# Altium schematic sheet Title.SchDoc
size 420 x 297 mm; SheetNumber: 1; SheetTotal: 3
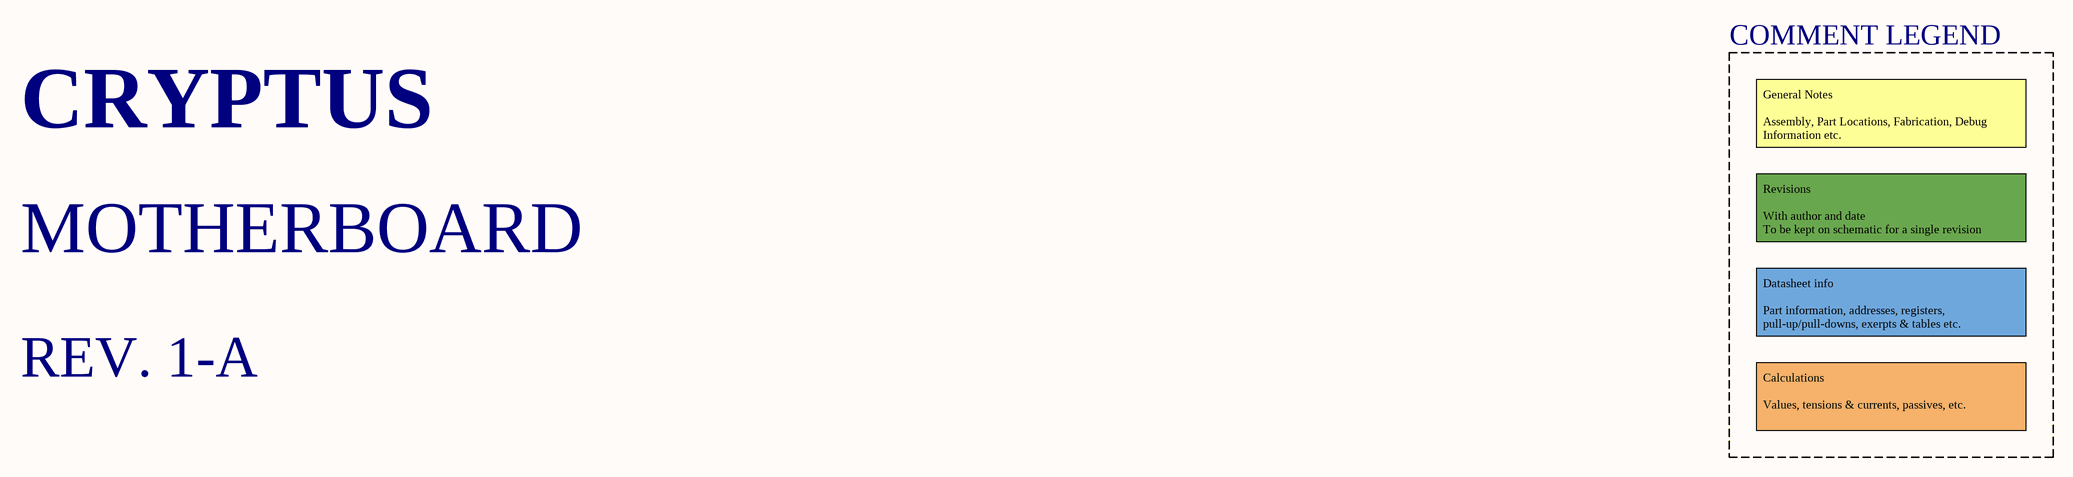
[diagram p0: Title.SchDoc]

## Notes on the sheet
- COMMENT LEGEND
- CRYPTUS
- General Notes
  Assembly, Part Locations, Fabrication, Debug Information etc.
- MOTHERBOARD
- Revisions
  With author and date
  To be kept on schematic for a single revision
- Datasheet info
  Part information, addresses, registers, pull-up/pull-downs, exerpts & tables etc.
- REV. 1-A
- Calculations
  Values, tensions & currents, passives, etc.
- PROJECT
- TITLE
- FILE NAME
- A3
- SIZE
- DWG NO.
- SHEET
- OF
- REV